# EAGLE schematic ZEROTH (EAGLE 9.5.2)
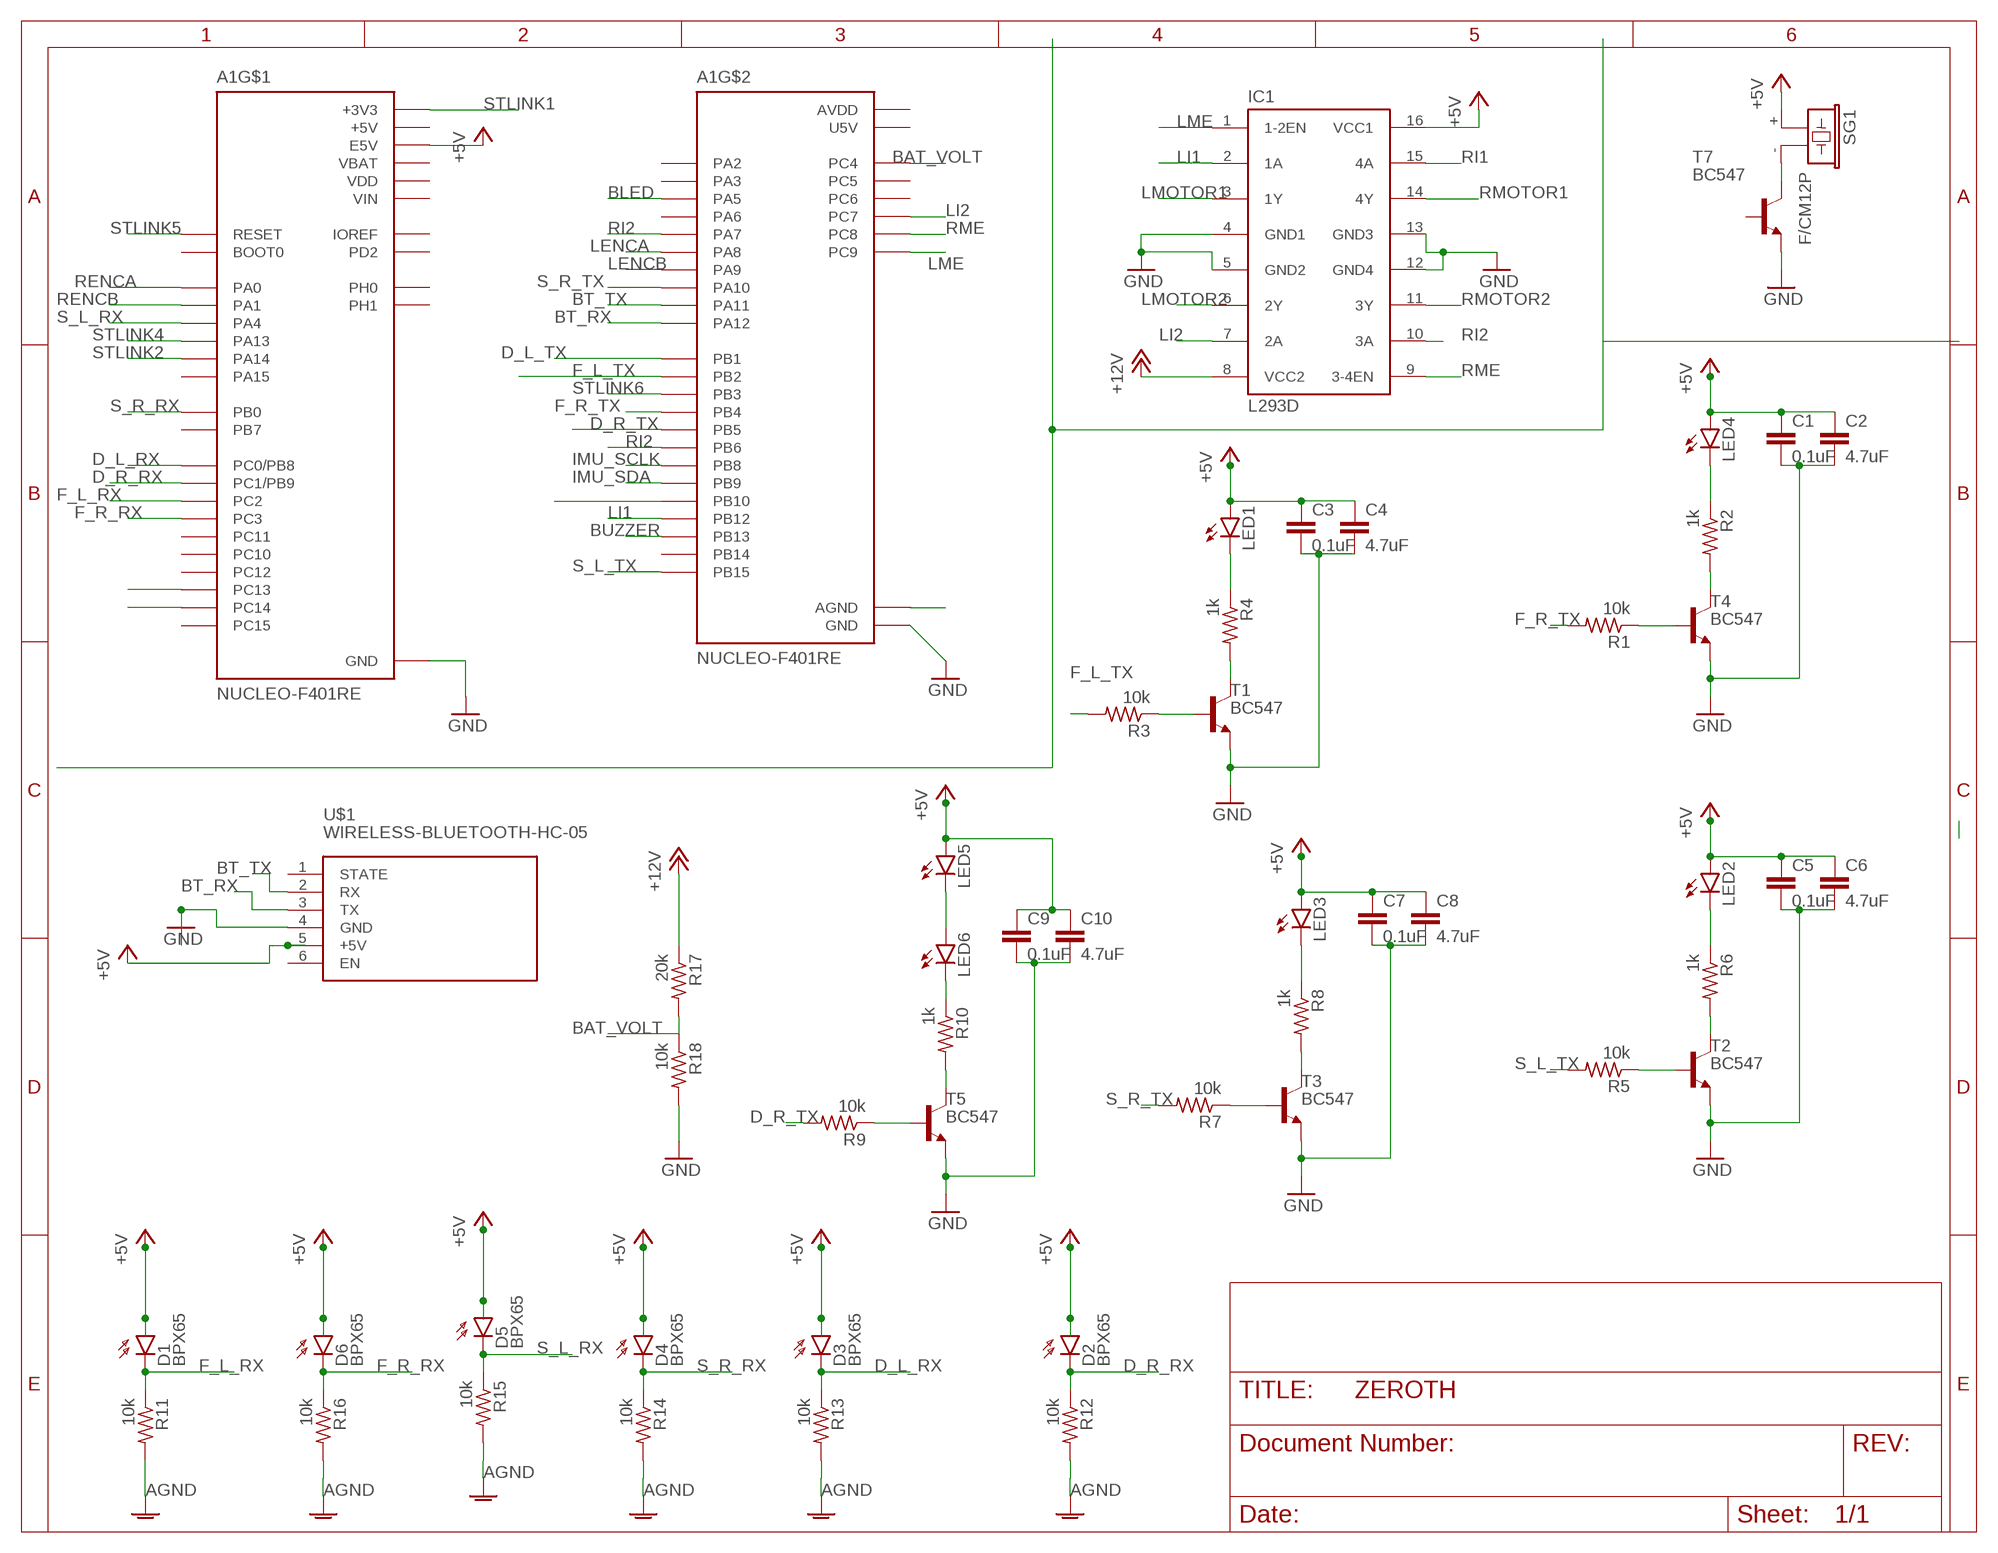
[diagram p0: schematic, sheet 1]

## Parts
A1  NUCLEO-F401RE  [ST_NUCLEO-F401RE]
C1  0.1uF  C2,5-3  [C2.5-3]
C2  4.7uF  C2,5-3  [C2.5-3]
C3  0.1uF  C2,5-3  [C2.5-3]
C4  4.7uF  C2,5-3  [C2.5-3]
C5  0.1uF  C2,5-3  [C2.5-3]
C6  4.7uF  C2,5-3  [C2.5-3]
C7  0.1uF  C2,5-3  [C2.5-3]
C8  4.7uF  C2,5-3  [C2.5-3]
C9  0.1uF  C2,5-3  [C2.5-3]
C10  4.7uF  C2,5-3  [C2.5-3]
D1  BPX65  [BPX65]
D2  BPX65  [BPX65]
D3  BPX65  [BPX65]
D4  BPX65  [BPX65]
D5  BPX65  [BPX65]
D6  BPX65  [BPX65]
IC1  L293D  [DIL16]
LED1  LED5MM  [LED5MM]
LED2  LED5MM  [LED5MM]
LED3  LED5MM  [LED5MM]
LED4  LED5MM  [LED5MM]
LED5  LED5MM  [LED5MM]
LED6  LED5MM  [LED5MM]
R1  10k  R-US_0204/7  [0204/7]
R2  1k  R-US_0204/7  [0204/7]
R3  10k  R-US_0204/7  [0204/7]
R4  1k  R-US_0204/7  [0204/7]
R5  10k  R-US_0204/7  [0204/7]
R6  1k  R-US_0204/7  [0204/7]
R7  10k  R-US_0204/7  [0204/7]
R8  1k  R-US_0204/7  [0204/7]
R9  10k  R-US_0204/7  [0204/7]
R10  1k  R-US_0204/7  [0204/7]
R11  10k  R-US_0204/7  [0204/7]
R12  10k  R-US_0204/7  [0204/7]
R13  10k  R-US_0204/7  [0204/7]
R14  10k  R-US_0204/7  [0204/7]
R15  10k  R-US_0204/7  [0204/7]
R16  10k  R-US_0204/7  [0204/7]
R17  20k  R-US_0204/7  [0204/7]
R18  10k  R-US_0204/7  [0204/7]
SG1  F/CM12P  [F/CM12P]
T1  BC547  [TO92]
T2  BC547  [TO92]
T3  BC547  [TO92]
T4  BC547  [TO92]
T5  BC547  [TO92]
T7  BC547  [TO92]
U$1  WIRELESS-BLUETOOTH-HC-05  [WIRELESS-BLUETOOTH-HC-05]

## Nets
+5V: A1.CN7_6(E5V) C1.1 C2.1 C3.1 C4.1 C5.1 C6.1 C7.1 C8.1 C9.1 C10.1 D1.A D2.A D3.A D4.A D5.A D6.A IC1.16(VCC1) LED1.A LED2.A LED3.A LED4.A LED5.A SG1.+ U$1.5(+5V)
+12V: IC1.8(VCC2) R17.1
AGND: A1.CN10_32(AGND) R11.2 R12.2 R13.2 R14.2 R15.2 R16.2
BAT_VOLT: A1.CN10_34(PC4) R17.2 R18.1
BLED: A1.CN10_11(PA5)
BT_RX: A1.CN10_12(PA12) U$1.3(TX)
BT_TX: A1.CN10_14(PA11) U$1.2(RX)
BUZZER: A1.CN10_30(PB13)
D_L_RX: A1.CN7_38(PC0/PB8) D3.K(C) R13.1
D_L_TX: A1.CN10_24(PB1)
D_R_RX: A1.CN7_36(PC1/PB9) D2.K(C) R12.1
D_R_TX: A1.CN10_29(PB5) R9.2
F_L_RX: A1.CN7_35(PC2) D1.K(C) R11.1
F_L_TX: A1.CN10_22(PB2) R3.2
F_R_RX: A1.CN7_37(PC3) D6.K(C) R16.1
F_R_TX: A1.CN10_27(PB4) R1.2
GND: A1.CN7_8(GND) A1.CN7_19(GND) A1.CN7_20(GND) A1.CN7_22(GND) A1.CN10_9(GND) A1.CN10_20(GND) C1.2 C2.2 C3.2 C4.2 C5.2 C6.2 C7.2 C8.2 C9.2 C10.2 IC1.4(GND1) IC1.5(GND2) IC1.12(GND4) IC1.13(GND3) R18.2 T1.1(E) T2.1(E) T3.1(E) T4.1(E) T5.1(E) T7.1(E) U$1.4(GND)
IMU_SCLK: A1.CN10_3(PB8)
IMU_SDA: A1.CN10_5(PB9)
LENCA: A1.CN10_23(PA8)
LENCB: A1.CN10_21(PA9)
LI1: A1.CN10_16(PB12) IC1.2(1A)
LI2: A1.CN10_19(PC7) IC1.7(2A)
LME: A1.CN10_1(PC9) IC1.1(1-2EN)
LMOTOR1: IC1.3(1Y)
LMOTOR2: IC1.6(2Y)
N$4: SG1.- T7.3(C)
N$5: R1.1 T4.2(B)
N$6: A1.CN7_23(PC13)
N$7: LED4.K(C) R2.1
N$8: R2.2 T4.3(C)
N$9: R5.1 T2.2(B)
N$11: A1.CN10_25(PB10)
N$12: A1.CN7_25(PC14)
N$13: R3.1 T1.2(B)
N$15: LED1.K(C) R4.1
N$16: R4.2 T1.3(C)
N$17: LED2.K(C) R6.1
N$18: R6.2 T2.3(C)
N$19: R7.1 T3.2(B)
N$21: LED3.K(C) R8.1
N$22: R8.2 T3.3(C)
N$23: R9.1 T5.2(B)
N$25: LED5.K(C) LED6.A
N$26: R10.2 T5.3(C)
N$27: LED6.K(C) R10.1
RENCA: A1.CN7_28(PA0)
RENCB: A1.CN7_30(PA1)
RI1: IC1.15(4A)
RI2: A1.CN10_15(PA7) A1.CN10_17(PB6) IC1.10(3A)
RME: A1.CN10_2(PC8) IC1.9(3-4EN)
RMOTOR1: IC1.14(4Y)
RMOTOR2: IC1.11(3Y)
S_L_RX: A1.CN7_32(PA4) D5.K(C) R15.1
S_L_TX: A1.CN10_26(PB15) R5.2
S_R_RX: A1.CN7_34(PB0) D4.K(C) R14.1
S_R_TX: A1.CN10_33(PA10) R7.2
STLINK1: A1.CN7_16(+3V3)
STLINK2: A1.CN7_15(PA14)
STLINK4: A1.CN7_13(PA13)
STLINK5: A1.CN7_14(RESET)
STLINK6: A1.CN10_31(PB3)
Unconnected: A1.CN5_1(D8) A1.CN5_2(D9) A1.CN5_3(D10) A1.CN5_4(D11) A1.CN5_5(D12) A1.CN5_6(D13) A1.CN5_9(D14) A1.CN5_10(D15) A1.CN6_2(IOREF) A1.CN6_3(RESET) A1.CN7_1(PC10) A1.CN7_2(PC11) A1.CN7_3(PC12) A1.CN7_4(PD2) A1.CN7_7(BOOT0) A1.CN7_12(IOREF) A1.CN7_17(PA15) A1.CN7_21(PB7) A1.CN7_27(PC15) A1.CN7_29(PH0) A1.CN7_31(PH1) A1.CN8_1(A0) A1.CN8_2(A1) A1.CN8_3(A2) A1.CN8_4(A3) A1.CN8_5(A4) A1.CN8_6(A5) A1.CN9_1(D0) A1.CN9_2(D1) A1.CN9_3(D2) A1.CN9_4(D3) A1.CN9_5(D4) A1.CN9_6(D5) A1.CN9_7(D6) A1.CN9_8(D7) A1.CN10_4(PC6) A1.CN10_6(PC5) A1.CN10_13(PA6) A1.CN10_28(PB14) A1.CN10_35(PA2) A1.CN10_37(PA3) T7.2(B) U$1.1(STATE) U$1.6(EN)

## Power pins joined to a net without a drawn wire
+3V3: A1.CN6_4(+3V3)
+5V: A1.CN6_5(+5V) A1.CN7_18(+5V)
AREF: A1.CN5_8(AREF)
AVDD: A1.CN10_7(AVDD)
GND: A1.CN5_7(GND) A1.CN6_6(GND) A1.CN6_7(GND)
U5V: A1.CN10_8(U5V)
VBAT: A1.CN7_33(VBAT)
VDD: A1.CN7_5(VDD)
VIN: A1.CN6_8(VIN) A1.CN7_24(VIN)

## Library data of the parts
A1 = NUCLEO-F401RE:NUCLEO-F401RE: STM32 Nucleo-64 development board with STM32F401RET6 MCU, supports Arduino and ST morpho connectivity; AVAILABILITY: Unavailable; DESCRIPTION: STM32F401RE, mbed-Enabled Development Nucleo-64 STM32F4 ARM® Cortex®-M4 MCU 32-Bit Embedded Evaluation Board; MF: STMicroelectronics; MP: NUCLEO-F401RE; PACKAGE: None; PRICE: None
C1-C10 = capacitor-wima:C: CAPACITOR naming: grid - package width
D1-D6 = opto-trans-siemens:BPX65: PHOTO DIODE; MPN: BPX65.; OC_FARNELL: 327451; OC_NEWARK: 06WX2764
IC1 = st-microelectronics:L293D: PUSH-PULL 4 CHANNEL DRIVER; MPN: L293D; OC_FARNELL: 9589619; OC_NEWARK: 56P8249
LED1-LED6 = led:LED: LED OSRAM: - CHIPLED LG R971, LG N971, LY N971, LG Q971, LY Q971, LO R971, LY R971 LH N974, LH R974 LS Q976, LO Q976, LY Q976 LO Q996 - Hyper CHIPLED LW Q18S LB Q993, LB Q99A, LB R99A - SideLED LS A670, LO A670, LY A670, LG A670, LP A670 LB A673, LV A673, LT A673, LW A673 LH A674 LY A675 LS A676, LA A676, LO A676, LY A676, LW A676 LS A679, LY A679, LG A679 - Hyper Micro SIDELED® LS Y876, LA Y876, LO Y876, LY Y876 LT Y87S - SmartLED LW L88C, LW L88S LB L89C, LB L89S, LG L890 LS L89K, LO L89K, LY L89K LS L896, LA L896, LO L896, LY L896 - TOPLED LS T670, LO T670, LY T670, LG T670, LP T670 LSG T670, LSP T670, LSY T670, LOP T670, LYG T670 LG T671, LOG T671, LSG T671 LB T673, LV T673, LT T673, LW T673 LH T674 LS T676, LA T676, LO T676, LY T676, LB T676, LH T676, LSB T676, LW T676 LB T67C, LV T67C, LT T67C, LS T67K, LO T67K, LY T67K, LW E67C LS E67B, LA E67B, LO E67B, LY E67B, LB E67C, LV E67C, LT E67C LW T67C LS T679, LY T679, LG T679 LS T770, LO T770, LY T770, LG T770, LP T770 LB T773, LV T773, LT T773, LW T773 LH T774 LS E675, LA E675, LY E675, LS T675 LS T776, LA T776, LO T776, LY T776, LB T776 LHGB T686 LT T68C, LB T68C - Hyper Mini TOPLED® LB M676 - Mini TOPLED Santana® LG M470 LS M47K, LO M47K, LY M47K Source: http://www.osram.convergy.de LUXEON: - LUMILED® LXK2-PW12-R00, LXK2-PW12-S00, LXK2-PW14-U00, LXK2-PW14-V00 LXK2-PM12-R00, LXK2-PM12-S00, LXK2-PM14-U00 LXK2-PE12-Q00, LXK2-PE12-R00, LXK2-PE12-S00, LXK2-PE14-T00, LXK2-PE14-U00 LXK2-PB12-K00, LXK2-PB12-L00, LXK2-PB12-M00, LXK2-PB14-N00, LXK2-PB14-P00, LXK2-PB14-Q00 LXK2-PR12-L00, LXK2-PR12-M00, LXK2-PR14-Q00, LXK2-PR14-R00 LXK2-PD12-Q00, LXK2-PD12-R00, LXK2-PD12-S00 LXK2-PH12-R00, LXK2-PH12-S00 LXK2-PL12-P00, LXK2-PL12-Q00, LXK2-PL12-R00 Source: www.luxeon.com KINGBRIGHT: KA-3528ASYC Source: www.kingbright.com
R1-R18 = rcl:R-US_: RESISTOR, American symbol; SPICEPREFIX: R
SG1 = buzzer:F/CM12P: BUZZER Source: Buerklin; OC_FARNELL: unknown; OC_NEWARK: unknown
T1-T5 T7 = transistor:BC547: NPN TRANSISTOR
U$1 = diy-modules:WIRELESS-BLUETOOTH-HC-05: Bluetooth Transceiver Module based on HC-05 board Tutorial is available here: https://arduino-info.wikispaces.com/BlueTooth-HC05-HC06-Modules-How-To Click here to find device on ebay.com <http://www.ebay.com/sch/hc-05+module+rs232>